# EAGLE design ESP8266 Programmer (EAGLE 7.3.0)
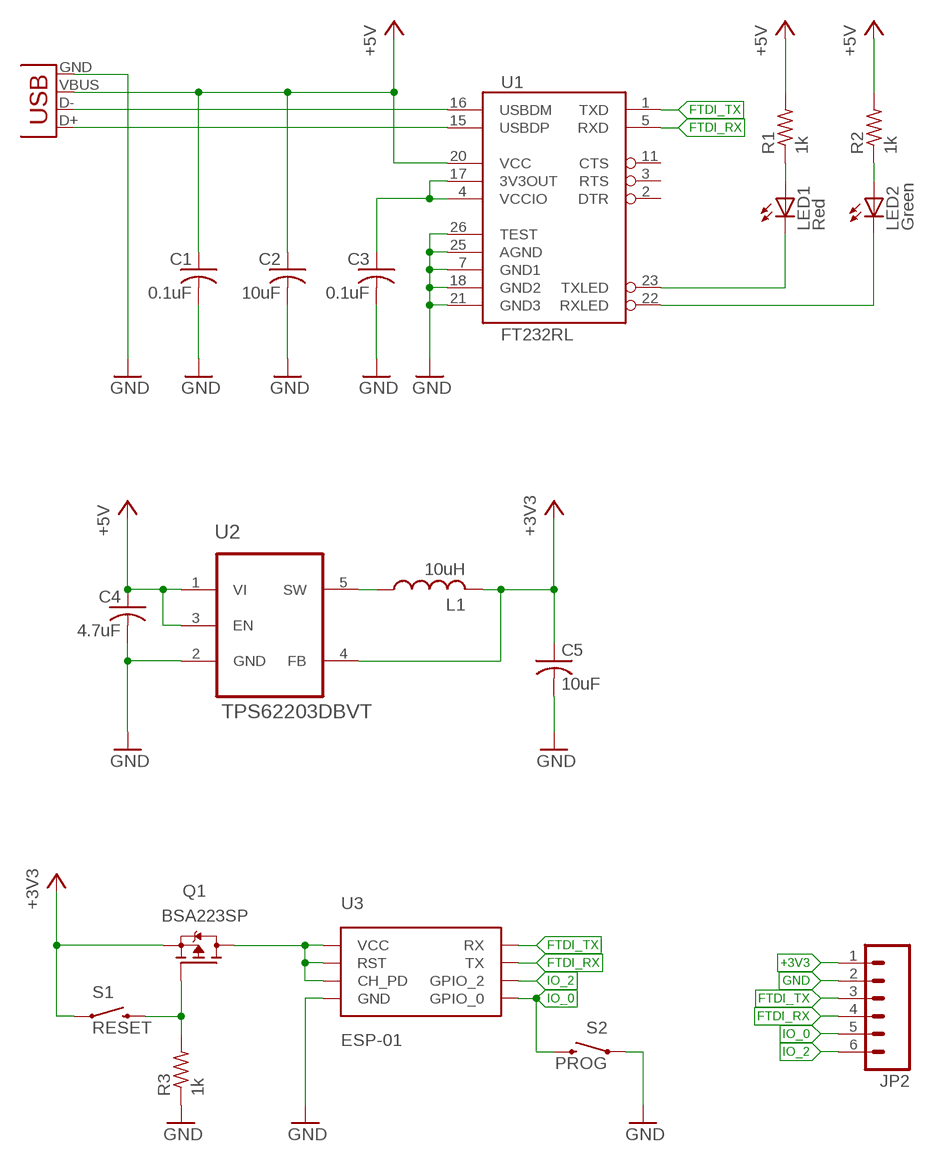
[diagram p0: schematic, sheet 1]

## Parts
C1  0.1uF  C-USC0603  [C0603]
C2  10uF  C-USC0603  [C0603]
C3  0.1uF  C-USC0603  [C0603]
C4  4.7uF  C-USC0603  [C0603]
C5  10uF  C-USC0603  [C0603]
JP1  USBSMD  [USB-MINIB]
JP2  M06NO_SILK  [1X06_NO_SILK]
L1  10uH  L-US  [L0806]
LED1  Red  LEDCHIPLED_0805  [CHIPLED_0805]
LED2  Green  LEDCHIPLED_0805  [CHIPLED_0805]
Q1  BSA223SP  [SC75_INFINEON]
R1  1k  R-US_R0603  [R0603]
R2  1k  R-US_R0603  [R0603]
R3  1k  R-US_R0603  [R0603]
S1  RESET  SWITCH-MOMENTARY-2SMD-4  [TACTILE_SWITCH_TALL]
S2  PROG  SWITCH-MOMENTARY-2SMD-4  [TACTILE_SWITCH_TALL]
U1  FT232RL  FT232RL-BASICSSOP  [SSOP28DB]
U2  TPS62203DBVT  [SOT95P280X145-5N]
U3  ESP-01  [ESP-01]

## Nets
+3V3: C5.1 JP2.1 L1.2 Q1.3(S) S1.A2 U2.4(FB)
+5V: C1.1 C2.1 C4.1 JP1.VBUS R1.2 R2.2 U1.20(VCC) U2.1(VI) U2.3(EN)
FTDI_RX: JP2.4 U1.5(RXD) U3.TX
FTDI_TX: JP2.3 U1.1(TXD) U3.RX
GND: C1.2 C2.2 C3.2 C4.2 C5.2 JP1.GND JP2.2 R3.1 S2.A2 U1.7(GND1) U1.18(GND2) U1.21(GND3) U1.25(AGND) U1.26(TEST) U2.2(GND) U3.GND
IO_0: JP2.5 S2.B2 U3.GPIO_0
IO_2: JP2.6 U3.GPIO_2
N$1: JP1.D- U1.16(USBDM)
N$2: JP1.D+ U1.15(USBDP)
N$3: Q1.2(D) U3.CH_PD U3.RST U3.VCC
N$4: C3.1 U1.4(VCCIO) U1.17(3V3OUT)
N$5: L1.1 U2.5(SW)
N$6: LED1.C U1.23(TXLED)
N$7: LED2.C U1.22(RXLED)
N$8: Q1.1(G) R3.2 S1.B2
N$9: LED1.A R1.1
N$10: LED2.A R2.1
Unconnected: U1.2(DTR) U1.3(RTS) U1.11(CTS)

## Library data of the parts
C1-C5 = resistor:C-US: CAPACITOR, American symbol
JP1 = SparkFun-Connectors:USB: USB Connectors USB-B-PTH is fully proven SKU : PRT-00139/CONN-08278 USB-miniB is fully proven SKU : PRT-00587 USB-A-PCB is untested. USB-A-H is throughly reviewed, but untested. Spark Fun Electronics SKU : PRT-00437 USB-B-SMT is throughly reviewed, but untested. Needs silkscreen touching up. USB-A-S has not been used/tested USB-MB-H has not been used/tested USB-MICROB has been used. CONN-09505; PROD_ID: CONN-08193
JP2 = SparkFun-Connectors:M06: Header 6 Standard 6-pin 0.1" header. Use with straight break away headers (SKU : PRT-00116), right angle break away headers (PRT-00553), swiss pins (PRT-00743), machine pins (PRT-00117), and female headers (PRT-00115). Molex polarized connector foot print use with SKU : PRT-08094 with associated crimp pins and housings. NOTES ON THE VARIANTS LOCK and LOCK_LONGPADS... This footprint was designed to help hold the alignment of a through-hole component (i.e. 6-pin header) while soldering it into place. You may notice that each hole has been shifted either up or down by 0.005 of an inch from it's more standard position (which is a perfectly straight line). This slight alteration caused the pins (the squares in the middle) to touch the edges of the holes. Because they are alternating, it causes a "brace" to hold the component in place. 0.005 has proven to be the perfect amount of "off-center" position when using our standard breakaway headers. Although looks a little odd when you look at the bare footprint, once you have a header in there, the alteration is very hard to notice. Also,if you push a header all the way into place, it is covered up entirely on the bottom side. This idea of altering the position of holes to aid alignment will be further integrated into the Sparkfun Library for other footprints. It can help hold any component with 3 or more connection pins.
L1 = resistor:L-US: INDUCTOR, American symbol
LED1 LED2 = adafruit:LED: LED OSRAM: - CHIPLED LG R971, LG N971, LY N971, LG Q971, LY Q971, LO R971, LY R971 LH N974, LH R974 LS Q976, LO Q976, LY Q976 LO Q996 - Hyper CHIPLED LW Q18S LB Q993, LB Q99A, LB R99A - SideLED LS A670, LO A670, LY A670, LG A670, LP A670 LB A673, LV A673, LT A673, LW A673 LH A674 LY A675 LS A676, LA A676, LO A676, LY A676, LW A676 LS A679, LY A679, LG A679 - Hyper Micro SIDELED® LS Y876, LA Y876, LO Y876, LY Y876 LT Y87S - SmartLED LW L88C, LW L88S LB L89C, LB L89S, LG L890 LS L89K, LO L89K, LY L89K LS L896, LA L896, LO L896, LY L896 - TOPLED LS T670, LO T670, LY T670, LG T670, LP T670 LSG T670, LSP T670, LSY T670, LOP T670, LYG T670 LG T671, LOG T671, LSG T671 LB T673, LV T673, LT T673, LW T673 LH T674 LS T676, LA T676, LO T676, LY T676, LB T676, LH T676, LSB T676, LW T676 LB T67C, LV T67C, LT T67C, LS T67K, LO T67K, LY T67K, LW E67C LS E67B, LA E67B, LO E67B, LY E67B, LB E67C, LV E67C, LT E67C LW T67C LS T679, LY T679, LG T679 LS T770, LO T770, LY T770, LG T770, LP T770 LB T773, LV T773, LT T773, LW T773 LH T774 LS E675, LA E675, LY E675, LS T675 LS T776, LA T776, LO T776, LY T776, LB T776 LHGB T686 LT T68C, LB T68C - Hyper Mini TOPLED® LB M676 - Mini TOPLED Santana® LG M470 LS M47K, LO M47K, LY M47K Source: http://www.osram.convergy.de/
Q1 = transistor-fet:BSA223SP: OptiMOS(R)-P Small-Signal-Transistor P-Channel, Enhancement mode, Super Logic Level (2.5 V rated) Source: http://www.infineon.com/upload/Document/BSA223SP_Rev1.3.pdf
R1-R3 = resistor:R-US_: RESISTOR, American symbol
S1 S2 = SparkFun-Electromechanical:SWITCH-MOMENTARY-2: Various NO switches- pushbuttons, reed, etc; PROD_ID: SWCH-11966
U1 = SparkFun-DigitalIC:FT232RL-BASIC: USB UART This is the simplified version of the FT232RL unit. Only what you need, nothing you don't. Spark Fun Electronics SKU : COM-00650
U2 = Texas Instruments_By_element14:TPS62203DBVT: HIGH-EFFICIENCY, SOT23 STEP-DOWN, DC-DC CONVERTER; MPN: TPS62203DBVT; OC_FARNELL: 8458049; OC_NEWARK: 36K7662; PACKAGE: SOT-23-5; SUPPLIER: Texas Instruments
U3 = Alex:ESP-01

## Board
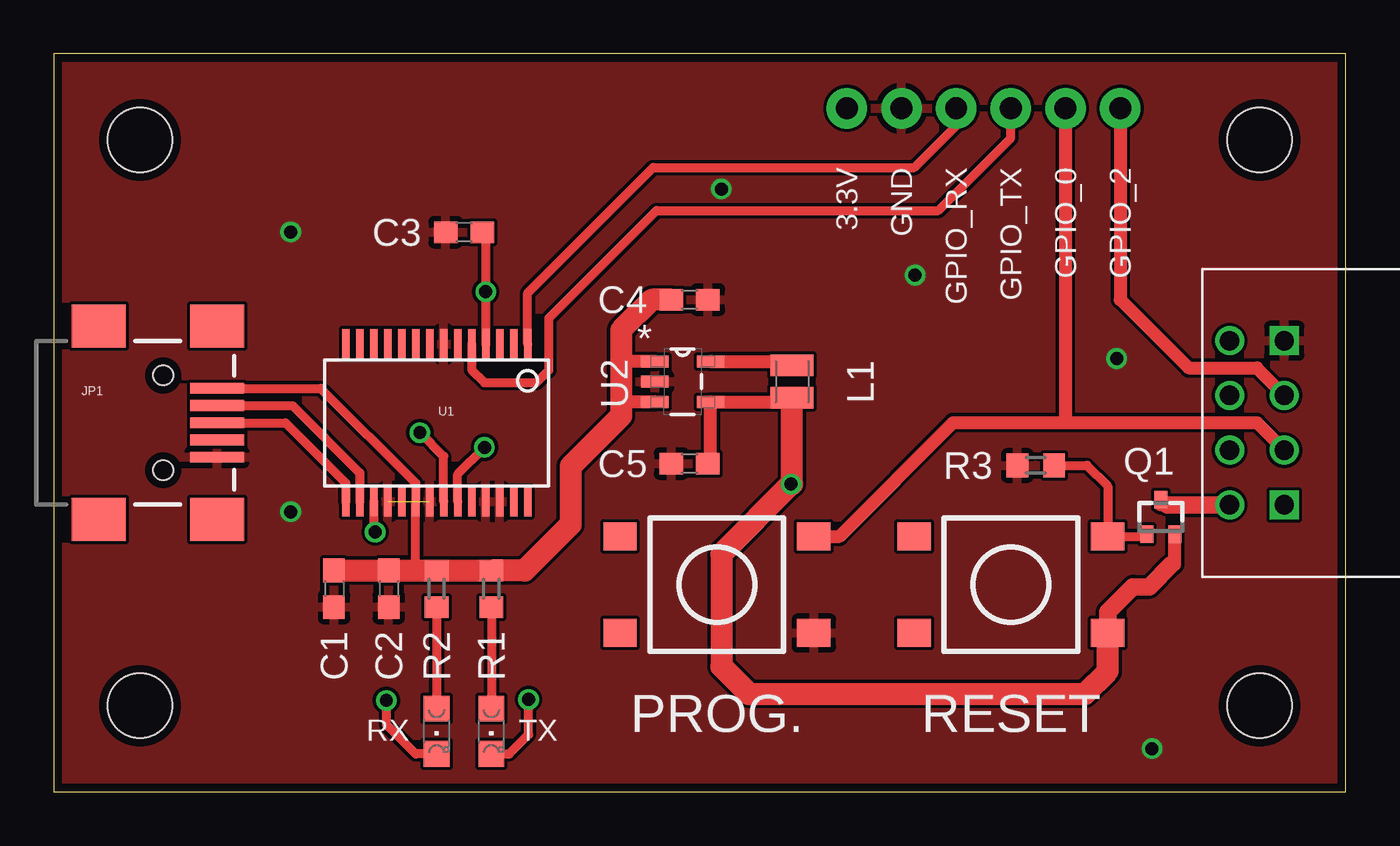
[diagram p1: board, top side]
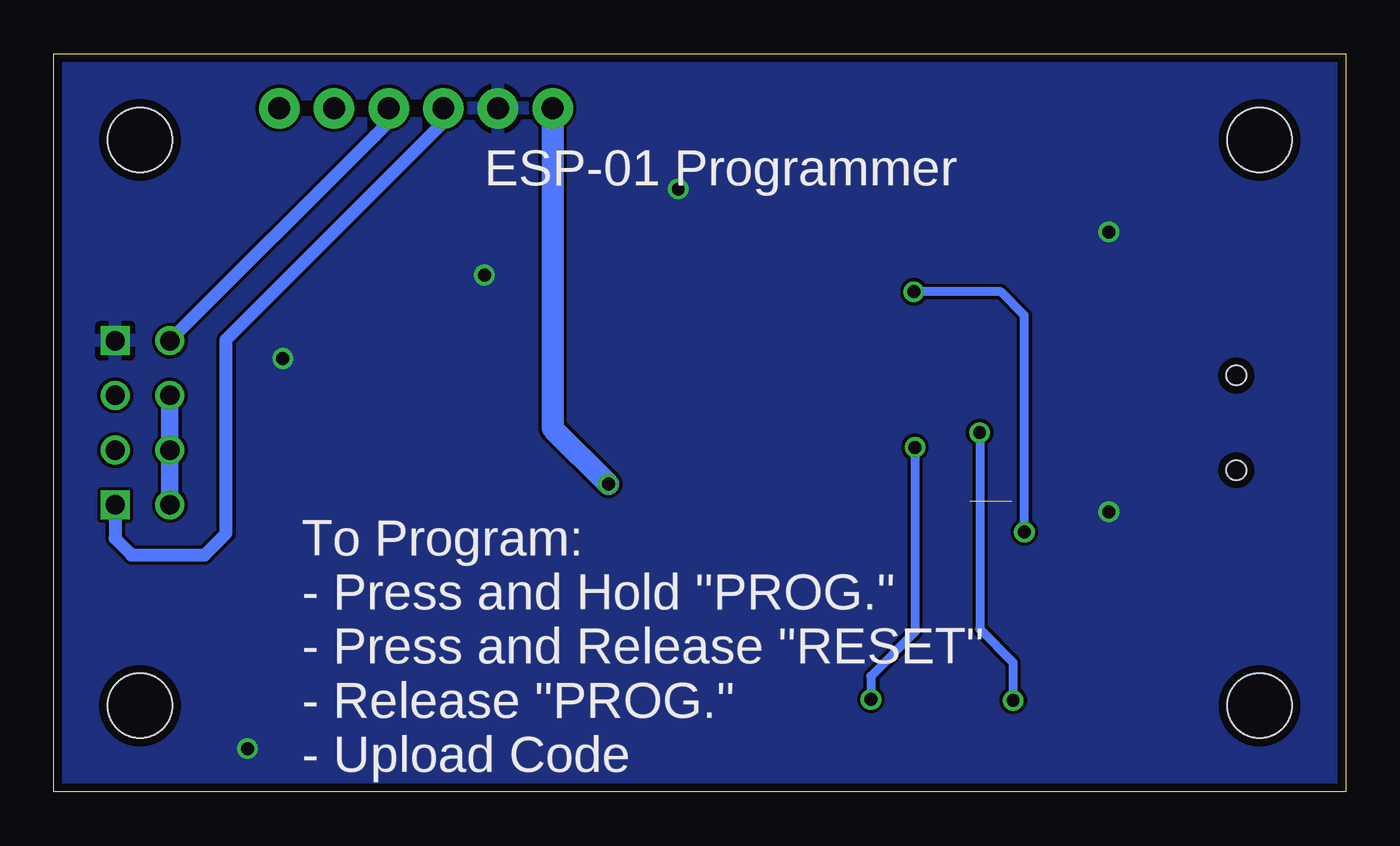
[diagram p2: board, bottom side, seen from below]

Size 60 x 34.28 mm. Coordinates in mm from the lower left corner, seen from the top.
Outline: 0,0 60,0 60,34.28 0,34.28 0,0
Copper layers (1*16): Top 0.0356mm / dielectric 1.5011mm / Bottom 0.0356mm
Design rules "Oshpark *": minimum track width 6mil, minimum drill 13mil, track to track 6mil, track to pad 6mil, pad to pad 6mil, via to via 6mil, smd to smd 6mil, copper to edge 15mil, drill to drill 6mil, minimum pad ring 7mil, minimum via ring 7mil, stop-mask expansion 3mil, vias tented up to drill 25mil, thermal gap 10mil
Holes 3 mm at 4,30.28 4,4 56,4 56,30.28

### Footprints (pad centres in the part's own frame; a part is rotated, then mirrored left to right if it is on the bottom)
C0603 = smd 1.1 x 1: 1 -0.85,0; 2 0.85,0
USB-MINIB = smd 2.5 x 0.5: D+ 2.5,0; D- 2.5,0.8; GND 2.5,-1.6; ID 2.5,-0.8; VBUS 2.5,1.6 | smd 2.5 x 2: MTN1 -3,4.5; MTN2 2.5,4.5; MTN3 -3,-4.5; MTN4 2.5,-4.5 | hole 0.9: 0,2.2; 0,-2.2
1X06_NO_SILK = drill 1.016 pad 1.88: 1 0,0; 2 2.54,0; 3 5.08,0; 4 7.62,0; 5 10.16,0; 6 12.7,0
L0806 = smd 1 x 2: 1 -0.75,0; 2 0.75,0
CHIPLED_0805 = smd 1.2 x 1.2: A 0,-1.05; C 0,1.05
SC75_INFINEON = smd 0.6 x 0.8: 1 -0.65,-0.8; 2 0,0.8; 3 0.65,-0.8
R0603 = smd 1 x 1.1: 1 -0.85,0; 2 0.85,0
TACTILE_SWITCH_TALL = smd 1.55 x 1.3: A1 -4.5,-2.25; A2 4.5,-2.25; B1 -4.5,2.25; B2 4.5,2.25
SSOP28DB = smd 0.348 x 1.397: 1 -4.225,-3.656; 2 -3.575,-3.656; 3 -2.925,-3.656; 4 -2.275,-3.656; 5 -1.625,-3.656; 6 -0.975,-3.656; 7 -0.325,-3.656; 8 0.325,-3.656; 9 0.975,-3.656; 10 1.625,-3.656; 11 2.275,-3.656; 12 2.925,-3.656; 13 3.575,-3.656; 14 4.225,-3.656; 15 4.225,3.656; 16 3.575,3.656; 17 2.925,3.656; 18 2.275,3.656; 19 1.625,3.656; 20 0.975,3.656; 21 0.325,3.656; 22 -0.325,3.656; 23 -0.975,3.656; 24 -1.625,3.656; 25 -2.275,3.656; 26 -2.925,3.656; 27 -3.575,3.656; 28 -4.225,3.656
SOT95P280X145-5N = smd 1.27 x 0.559: 1 -1.295,0.94; 2 -1.295,0; 3 -1.295,-0.94; 4 1.295,-0.94; 5 1.295,0.94
ESP-01 = drill 0.9: CH_PD -1.27,1.27; GPIO_0 1.27,3.81; GPIO_2 -1.27,3.81; RST 1.27,1.27; TX -3.81,1.27; VCC 3.81,1.27 | drill 0.9 square: GND -3.81,3.81; RX 3.81,3.81

### Placement (x,y rotation side)
C1  13.02,9.43 270 top
C2  15.56,9.43 270 top
C3  19.05,25.99 180 top
C4  29.53,22.86 0 top
C5  29.53,15.24 180 top
JP1  5.08,17.14 0 top
JP2  36.83,31.75 0 top
L1  34.29,19.05 270 top
LED1  20.32,2.81 180 top
LED2  17.78,2.81 180 top
Q1  51.41,12.76 0 top
R1  20.32,9.43 90 top
R2  17.78,9.43 90 top
R3  45.6,15.16 0 top
S1  44.45,9.62 0 top
S2  30.8,9.62 0 top
U1  17.78,17.14 180 top
U2  29.21,19.05 0 top
U3  53.34,17.14 270 top

### Tracks (layer width: path | path; a pad name or v marks a point on that pad's centre or on a via)
+3V3  (via drill 0.6)
  Top 0.61: C5.1 30.48,15.24 30.5,15.27 U2.4 34.29,18.11 L1.2 | 51.91,10.55 52.06,10.55 Q1.3
  Top 0.813: 51.91,10.55 50.88,9.53 50.12,9.53 48.95,8.35 S1.A2
  Top 1.016: S1.A2 48.95,5.6 47.89,4.54 32.28,4.54 31,5.82 31,11.04 v34.24,14.29 34.29,14.29 L1.2
  Bottom 1.016: JP2.1 36.83,16.88 v34.24,14.29
+5V
  Top 0.406: R2.2 16.8,10.28 U1.20 16.8,14.34 12.4,18.74 JP1.VBUS
  Top 0.61: U2.1 26.35,19.99 26.35,20 | U2.3 26.35,18.11 26.35,18
  Top 1.016: C1.1 C2.1 R2.2 R1.2 21.87,10.28 24,12.41 24,15.11 26.35,17.46 26.35,18 26.35,20 26.35,21.44 27.77,22.86 C4.1
FTDI_RX
  Top 0.406: U1.5 19.41,19.59 20,19 22.41,19 23,19.59 23,22 28,27 41.08,27 44.45,30.37 JP2.4
  Bottom 0.61: U3.TX 45.09,30.48 44.45,31.11 JP2.4
FTDI_TX
  Top 0.406: U1.1 22,23.17 27.83,29 39.96,29 41.91,30.95 JP2.3
  Bottom 0.61: U3.RX 57.15,11.77 56.38,11 53,11 52,12 52,21 41.91,31.09 JP2.3
GND  (via drill 0.6)  (1 unrouted)
  other vias: 11,26 31,28 11,13 49.37,20.12 51,2 40,24
  pour Top: -1,35 61,35 61,-1 -1,-1
  pour Bottom: -2,36 62,36 62,-2 -2,-2
IO_0
  Top 0.61: U3.GPIO_0 55.88,17.14 46.99,17.14 | S2.B2 36.49,11.87 41.77,17.14 46.99,17.14 | JP2.5 46.99,17.14
IO_2
  Top 0.61: U3.GPIO_2 55.88,19.68 52.7,19.68 49.53,22.86 JP2.6
N$1
  Top 0.406: JP1.D- 11.08,17.94 14.21,14.82 U1.16
N$2
  Top 0.406: JP1.D+ 10.76,17.14 13.55,14.34 U1.15
N$3
  Top 0.61: 51.72,13.33 51.41,13.33 Q1.2
  Top 0.813: 51.72,13.33 U3.VCC
  Bottom 0.813: U3.CH_PD U3.RST U3.VCC
N$4  (via drill 0.6)
  Top 0.406: C3.1 20.05,25.99 v20.05,23.23 U1.4 | U1.17 14.86,12.06 v14.92,12.06
  Bottom 0.406: v14.92,12.06 14.92,22.12 16.02,23.23 v20.05,23.23
N$5
  Top 0.61: U2.5 34.29,19.99 L1.1
N$6  (via drill 0.6)
  Top 0.406: U1.23 18.75,14.76 v20,16 | LED1.C 21.14,1.76 22.05,2.67 v22.05,4.29
  Bottom 0.406: v20,16 20,7.41 22.05,5.36 v22.05,4.29
N$7  (via drill 0.6)
  Top 0.406: U1.22 18.11,15.58 v17,16.68 | LED2.C 16.8,1.76 15.45,3.12 v15.45,4.24
  Bottom 0.406: v17,16.68 17,7.55 15.45,6 v15.45,4.24
N$8
  Top 0.406: Q1.1 50.76,11.87 S1.B2 48.95,14.2 47.99,15.16 R3.2
N$9
  Top 0.406: R1.1 LED1.A
N$10
  Top 0.406: R2.1 LED2.A

### Text on the board
tPlace: 3.3V | GND | GPIO_RX | GPIO_TX | GPIO_0 | GPIO_2 | PROG. | RESET | RX | TX
bPlace: ESP-01 Programmer | To Program: / - Press and Hold "PROG." / - Press and Release "RESET" / - Release "PROG." / - Upload Code